# EAGLE design 1drv5 (EAGLE 7.2.0)
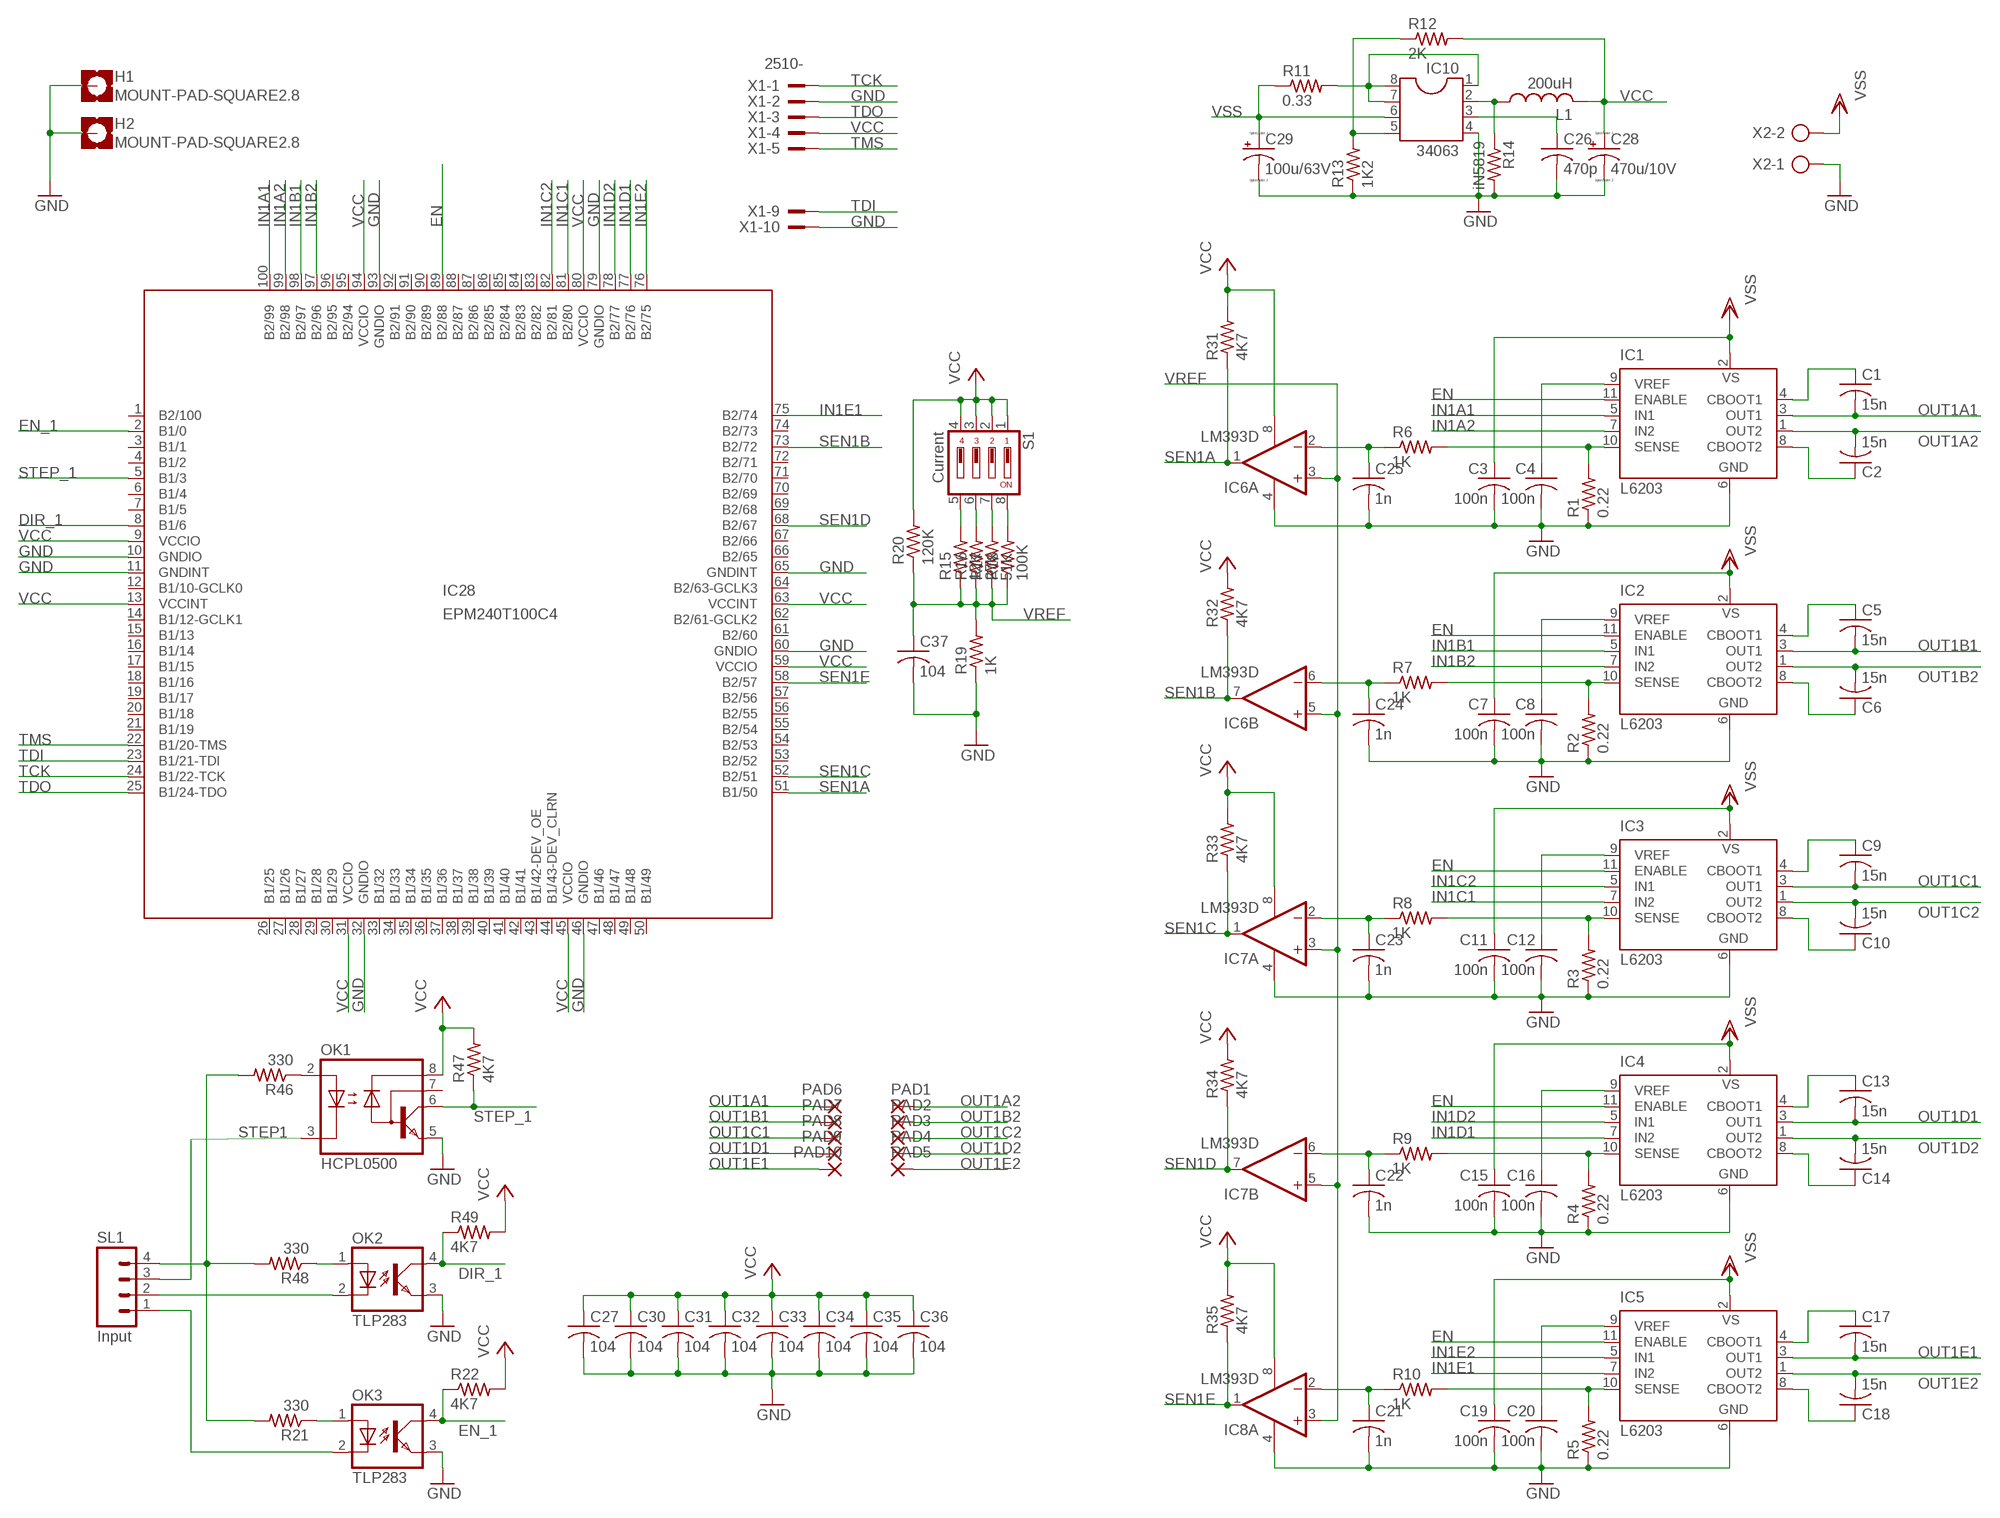
[diagram p0: schematic, sheet 1]

## Parts
C1  15n  C-US050-024X044  [C050-024X044]
C2  15n  C-US050-024X044  [C050-024X044]
C3  100n  C-US150-064X183  [C150-064X183]
C4  100n  C-US050-025X075  [C050-025X075]
C5  15n  C-US050-024X044  [C050-024X044]
C6  15n  C-US050-024X044  [C050-024X044]
C7  100n  C-US150-064X183  [C150-064X183]
C8  100n  C-US050-025X075  [C050-025X075]
C9  15n  C-US050-024X044  [C050-024X044]
C10  15n  C-US050-024X044  [C050-024X044]
C11  100n  C-US150-064X183  [C150-064X183]
C12  100n  C-US050-025X075  [C050-025X075]
C13  15n  C-US050-024X044  [C050-024X044]
C14  15n  C-US050-024X044  [C050-024X044]
C15  100n  C-US150-064X183  [C150-064X183]
C16  100n  C-US050-025X075  [C050-025X075]
C17  15n  C-US050-024X044  [C050-024X044]
C18  15n  C-US050-024X044  [C050-024X044]
C19  100n  C-US150-064X183  [C150-064X183]
C20  100n  C-US050-025X075  [C050-025X075]
C21  1n  C-USC1206  [C1206]
C22  1n  C-USC1206  [C1206]
C23  1n  C-USC1206  [C1206]
C24  1n  C-USC1206  [C1206]
C25  1n  C-USC1206  [C1206]
C26  470p  C-USC1206  [C1206]
C27  104  C-USC1206  [C1206]
C28  470u/10V  CPOL-USE3.5-8  [E3,5-8]
C29  100u/63V  CPOL-USE5-8.5  [E5-8,5]
C30  104  C-USC1206  [C1206]
C31  104  C-USC1206  [C1206]
C32  104  C-USC1206  [C1206]
C33  104  C-USC1206  [C1206]
C34  104  C-USC1206  [C1206]
C35  104  C-USC1206  [C1206]
C36  104  C-USC1206  [C1206]
C37  104  C-USC1206  [C1206]
H1  MOUNT-PAD-SQUARE2.8  [2,8-PAD-SQUARE]
H2  MOUNT-PAD-SQUARE2.8  [2,8-PAD-SQUARE]
IC1  L6203  [MULTIWATT-11]
IC2  L6203  [MULTIWATT-11]
IC3  L6203  [MULTIWATT-11]
IC4  L6203  [MULTIWATT-11]
IC5  L6203  [MULTIWATT-11]
IC6  LM393D  [SO08]
IC7  LM393D  [SO08]
IC8  LM393D  [SO08]
IC10  34063  DIL8  [DIL08]
IC28  EPM240T100C4  [TQFP100]
L1  200uH  L-US0207/5V  [0207/5V]
OK1  HCPL0500  [SOIC08]
OK2  TLP283  [MINI-FLAT-4]
OK3  TLP283  [MINI-FLAT-4]
PAD1  1,6/0,8  [1,6/0,8]
PAD2  1,6/0,8  [1,6/0,8]
PAD3  1,6/0,8  [1,6/0,8]
PAD4  1,6/0,8  [1,6/0,8]
PAD5  1,6/0,8  [1,6/0,8]
PAD6  1,6/0,8  [1,6/0,8]
PAD7  1,6/0,8  [1,6/0,8]
PAD8  1,6/0,8  [1,6/0,8]
PAD9  1,6/0,8  [1,6/0,8]
PAD10  1,6/0,8  [1,6/0,8]
R1  0.22  R-US_0411/3V  [0411V]
R2  0.22  R-US_0411/3V  [0411V]
R3  0.22  R-US_0411/3V  [0411V]
R4  0.22  R-US_0411/3V  [0411V]
R5  0.22  R-US_0411/3V  [0411V]
R6  1K  R-US_R1206  [R1206]
R7  1K  R-US_R1206  [R1206]
R8  1K  R-US_R1206  [R1206]
R9  1K  R-US_R1206  [R1206]
R10  1K  R-US_R1206  [R1206]
R11  0.33  R-US_0207/7  [0207/7]
R12  2K  R-US_0207/7  [0207/7]
R13  1K2  R-US_0207/7  [0207/7]
R14  iN5819  R-US_0414/5V  [0414V]
R15  12K  R-US_R1206  [R1206]
R16  27K  R-US_R1206  [R1206]
R17  51K  R-US_R1206  [R1206]
R18  100K  R-US_R1206  [R1206]
R19  1K  R-US_R1206  [R1206]
R20  120K  R-US_R1206  [R1206]
R21  330  R-US_R1206  [R1206]
R22  4K7  R-US_R1206  [R1206]
R31  4K7  R-US_R1206  [R1206]
R32  4K7  R-US_R1206  [R1206]
R33  4K7  R-US_R1206  [R1206]
R34  4K7  R-US_R1206  [R1206]
R35  4K7  R-US_R1206  [R1206]
R46  330  R-US_R1206  [R1206]
R47  4K7  R-US_R1206  [R1206]
R48  330  R-US_R1206  [R1206]
R49  4K7  R-US_R1206  [R1206]
S1  Current  DP04  [DP-04]
SL1  Input  M04  [04P]
X1  2510-  [PAK100/2500-10]
X2  AK500/2-H  [AK500/2-H]

## Nets
DIR_1: IC28.8(B1/6) OK2.4(COL) R49.1
EN: IC1.11(ENABLE) IC2.11(ENABLE) IC3.11(ENABLE) IC4.11(ENABLE) IC5.11(ENABLE) IC28.89(B2/88)
EN_1: IC28.2(B1/0) OK3.4(COL) R22.1
GND: C3.2 C4.2 C7.2 C8.2 C11.2 C12.2 C15.2 C16.2 C19.2 C20.2 C21.2 C22.2 C23.2 C24.2 C25.2 C26.2 C27.2 C28.- C29.- C30.2 C31.2 C32.2 C33.2 C34.2 C35.2 C36.2 C37.2 H1.B2,8(MOUNT) H2.B2,8(MOUNT) IC1.6(GND) IC2.6(GND) IC3.6(GND) IC4.6(GND) IC5.6(GND) IC6.4(P:V-) IC7.4(P:V-) IC8.4(P:V-) IC10.4 IC28.10(GNDIO) IC28.11(GNDINT) IC28.32(GNDIO) IC28.46(GNDIO) IC28.60(GNDIO) IC28.65(GNDINT) IC28.79(GNDIO) IC28.93(GNDIO) OK1.5(GND) OK2.3(EMIT) OK3.3(EMIT) R1.1 R2.1 R3.1 R4.1 R5.1 R13.1 R14.2 R19.1 X1.2 X1.10 X2.1
IN1A1: IC1.5(IN1) IC28.100(B2/99)
IN1A2: IC1.7(IN2) IC28.99(B2/98)
IN1B1: IC2.5(IN1) IC28.98(B2/97)
IN1B2: IC2.7(IN2) IC28.97(B2/96)
IN1C1: IC3.7(IN2) IC28.81(B2/80)
IN1C2: IC3.5(IN1) IC28.82(B2/81)
IN1D1: IC4.7(IN2) IC28.77(B2/76)
IN1D2: IC4.5(IN1) IC28.78(B2/77)
IN1E1: IC5.7(IN2) IC28.75(B2/74)
IN1E2: IC5.5(IN1) IC28.76(B2/75)
N$1: C8.1 IC2.9(VREF)
N$2: C1.1 IC1.4(CBOOT1)
N$3: C2.1 IC1.8(CBOOT2)
N$4: C4.1 IC1.9(VREF)
N$5: C5.1 IC2.4(CBOOT1)
N$6: C6.1 IC2.8(CBOOT2)
N$7: C12.1 IC3.9(VREF)
N$8: C9.1 IC3.4(CBOOT1)
N$9: C10.1 IC3.8(CBOOT2)
N$10: C16.1 IC4.9(VREF)
N$11: C13.1 IC4.4(CBOOT1)
N$12: C14.1 IC4.8(CBOOT2)
N$13: C20.1 IC5.9(VREF)
N$14: C17.1 IC5.4(CBOOT1)
N$15: C18.1 IC5.8(CBOOT2)
N$16: C25.1 IC6.2(A:-IN) R6.1
N$17: C21.1 IC8.2(A:-IN) R10.1
N$18: IC10.2 L1.1 R14.1
N$19: C22.1 IC7.6(B:-IN) R9.1
N$20: OK2.1(A) R48.1
N$21: C23.1 IC7.2(A:-IN) R8.1
N$22: C26.1 IC10.3
N$23: C24.1 IC6.6(B:-IN) R7.1
N$24: OK2.2(C) SL1.2
N$26: IC10.1 IC10.7 IC10.8 R11.2
N$27: R15.2 S1.5
N$28: R16.2 S1.6
N$29: IC10.5 R12.1 R13.2
N$30: R17.2 S1.7
N$31: R18.2 S1.8
N$33: R21.2 R46.2 R48.2 SL1.4
N$34: OK3.1(A) R21.1
N$35: OK3.2(C) SL1.1
N$62: OK1.2(A) R46.1
OUT1A1: C1.2 IC1.3(OUT1) PAD6.1(P)
OUT1A2: C2.2 IC1.1(OUT2) PAD1.1(P)
OUT1B1: C5.2 IC2.3(OUT1) PAD7.1(P)
OUT1B2: C6.2 IC2.1(OUT2) PAD2.1(P)
OUT1C1: C9.2 IC3.3(OUT1) PAD8.1(P)
OUT1C2: C10.2 IC3.1(OUT2) PAD3.1(P)
OUT1D1: C13.2 IC4.3(OUT1) PAD9.1(P)
OUT1D2: C14.2 IC4.1(OUT2) PAD4.1(P)
OUT1E1: C17.2 IC5.3(OUT1) PAD10.1(P)
OUT1E2: C18.2 IC5.1(OUT2) PAD5.1(P)
SEN1A: IC6.1(A:OUT) IC28.51(B1/50) R31.1
SEN1B: IC6.7(B:OUT) IC28.73(B2/72) R32.1
SEN1C: IC7.1(A:OUT) IC28.52(B2/51) R33.1
SEN1D: IC7.7(B:OUT) IC28.68(B2/67) R34.1
SEN1E: IC8.1(A:OUT) IC28.58(B2/57) R35.1
SEN_A: IC1.10(SENSE) R1.2 R6.2
SEN_B: IC2.10(SENSE) R2.2 R7.2
SEN_C: IC3.10(SENSE) R3.2 R8.2
SEN_D: IC4.10(SENSE) R4.2 R9.2
SEN_E: IC5.10(SENSE) R5.2 R10.2
STEP1: OK1.3(C) SL1.3
STEP_1: IC28.5(B1/3) OK1.6(VO) R47.1
TCK: IC28.24(B1/22-TCK) X1.1
TDI: IC28.23(B1/21-TDI) X1.9
TDO: IC28.25(B1/24-TDO) X1.3
TMS: IC28.22(B1/20-TMS) X1.5
VCC: C27.1 C28.+ C30.1 C31.1 C32.1 C33.1 C34.1 C35.1 C36.1 IC6.8(P:V+) IC7.8(P:V+) IC8.8(P:V+) IC28.9(VCCIO) IC28.13(VCCINT) IC28.31(VCCIO) IC28.45(VCCIO) IC28.59(VCCIO) IC28.63(VCCINT) IC28.80(VCCIO) IC28.94(VCCIO) L1.2 OK1.8(VCC) R12.2 R20.2 R22.2 R31.2 R32.2 R33.2 R34.2 R35.2 R47.2 R49.2 S1.1 S1.2 S1.3 S1.4 X1.4
VREF: C37.1 IC6.3(A:+IN) IC6.5(B:+IN) IC7.3(A:+IN) IC7.5(B:+IN) IC8.3(A:+IN) R15.1 R16.1 R17.1 R18.1 R19.2 R20.1
VSS: C3.1 C7.1 C11.1 C15.1 C19.1 C29.+ IC1.2(VS) IC2.2(VS) IC3.2(VS) IC4.2(VS) IC5.2(VS) IC10.6 R11.1 X2.2
Unconnected: IC8.5(B:+IN) IC8.6(B:-IN) IC8.7(B:OUT) IC28.1(B2/100) IC28.3(B1/1) IC28.4(B1/2) IC28.6(B1/4) IC28.7(B1/5) IC28.12(B1/10-GCLK0) IC28.14(B1/12-GCLK1) IC28.15(B1/13) IC28.16(B1/14) IC28.17(B1/15) IC28.18(B1/16) IC28.19(B1/17) IC28.20(B1/18) IC28.21(B1/19) IC28.26(B1/25) IC28.27(B1/26) IC28.28(B1/27) IC28.29(B1/28) IC28.30(B1/29) IC28.33(B1/32) IC28.34(B1/33) IC28.35(B1/34) IC28.36(B1/35) IC28.37(B1/36) IC28.38(B1/37) IC28.39(B1/38) IC28.40(B1/39) IC28.41(B1/40) IC28.42(B1/41) IC28.43(B1/42-DEV_OE) IC28.44(B1/43-DEV_CLRN) IC28.47(B1/46) IC28.48(B1/47) IC28.49(B1/48) IC28.50(B1/49) IC28.53(B2/52) IC28.54(B2/53) IC28.55(B2/54) IC28.56(B2/55) IC28.57(B2/56) IC28.61(B2/60) IC28.62(B2/61-GCLK2) IC28.64(B2/63-GCLK3) IC28.66(B2/65) IC28.67(B2/66) IC28.69(B2/68) IC28.70(B2/69) IC28.71(B2/70) IC28.72(B2/71) IC28.74(B2/73) IC28.83(B2/82) IC28.84(B2/83) IC28.85(B2/84) IC28.86(B2/85) IC28.87(B2/86) IC28.88(B2/87) IC28.90(B2/89) IC28.91(B2/90) IC28.92(B2/91) IC28.95(B2/94) IC28.96(B2/95) OK1.7(VB) X1.6 X1.7 X1.8

## Library data of the parts
C1-C27 C30-C37 = resistor:C-US: CAPACITOR, American symbol
C28 C29 = resistor:CPOL-US: POLARIZED CAPACITOR, American symbol
H1 H2 = holes:MOUNT-PAD-SQUARE: MOUNTING PAD, square
IC1-IC5 = st-microelectronics:L6203: DMOS FULL BRIDGE DRIVER; MPN: L6203; OC_FARNELL: 1467715; OC_NEWARK: 56P8434
IC6-IC8 = linear:LM393: COMPARATOR
IC10 = ic-package:DIL8: Dual In Line / Socket
IC28 = altera:EPM240T100C4: EPM240T100 Low-cost, low-power CPLD Auto generated by make-symbol-device-package-bsdl.ulp Rev. 35 Source: www.altera.com .. epm240-io.txt; MPN: EPM240T100C4; OC_FARNELL: 1453502; OC_NEWARK: 51R9357
L1 = resistor:L-US: INDUCTOR, American symbol
OK1 = optocoupler:HCPL0500: HEWLETT PACKARD OPTO COUPLER; MF: AGILENT TECHNOLOGIES; MPN: HCPL-0500-000E; OC_FARNELL: 9995226; OC_NEWARK: 31K6926
OK2 OK3 = optocoupler:TLP283: TOSHIBA PHOTOCOUPLER GaAs IRED & PHOTO-TRANSISTOR Source: http://www.semicon.toshiba.co.jp/td/en/Opto/Photocoupler/en_20050928_TLP283_datasheet.pdf; OC_FARNELL: unknown; OC_NEWARK: unknown
PAD1-PAD10 = wirepad:1,6/0,8: THROUGH-HOLE PAD
R1-R22 R31-R35 R46-R49 = resistor:R-US_: RESISTOR, American symbol
S1 = switch-dil:DP04: DIL/CODE SWITCH; MPN: DP04; OC_FARNELL: 9471600; OC_NEWARK: 73J0027
SL1 = con-amp-quick:M04: AMP QUICK CONNECTOR; OC_FARNELL: unknown; OC_NEWARK: unknown
X1 = con-3m:2510-: 3M (TM) Pak 100 4-Wall Header Source: 3M; MF: 3M; MPN: 2510-6002UB; OC_FARNELL: 9838244; OC_NEWARK: 46F4725
X2 = con-ptr500:AK500/2-H: CONNECTOR Aug. 2004 / PTR Meßtechnik: Die Bezeichnung der Serie AK505 wurde geändert. Es handelt sich hierbei um AK500 in horizontaler Ausführung.; OC_FARNELL: unknown; OC_NEWARK: unknown

## Board
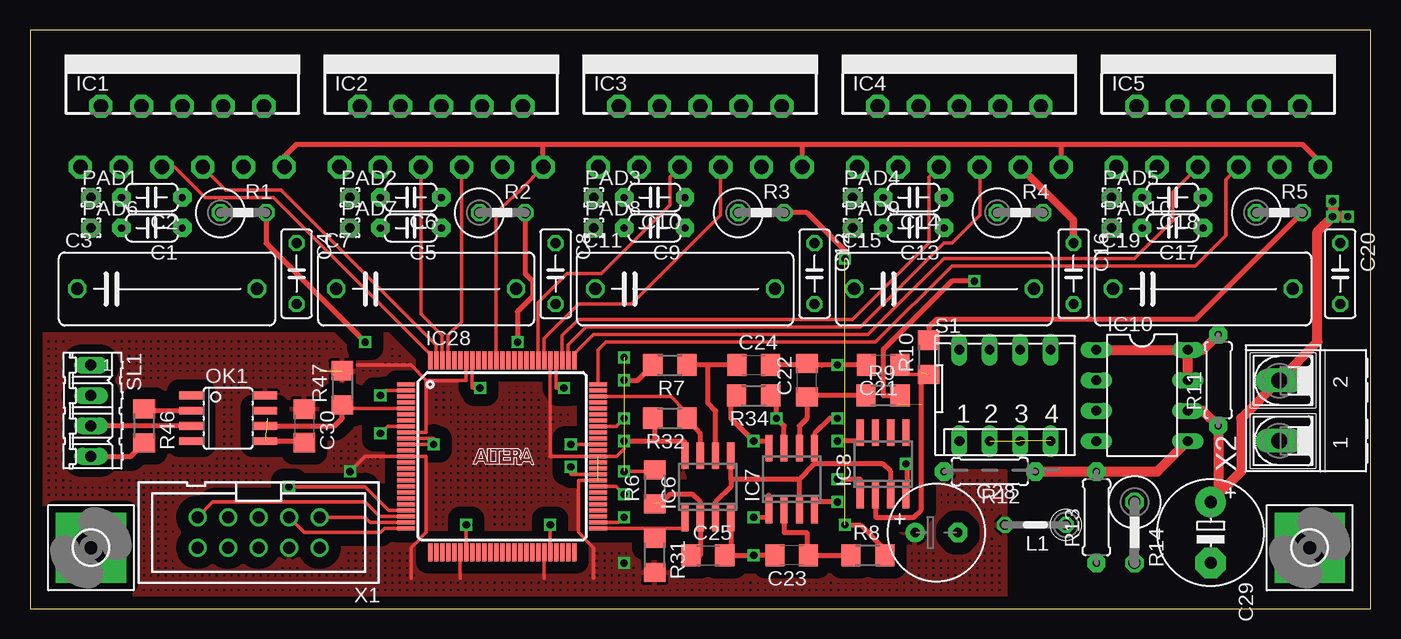
[diagram p1: board, top side]
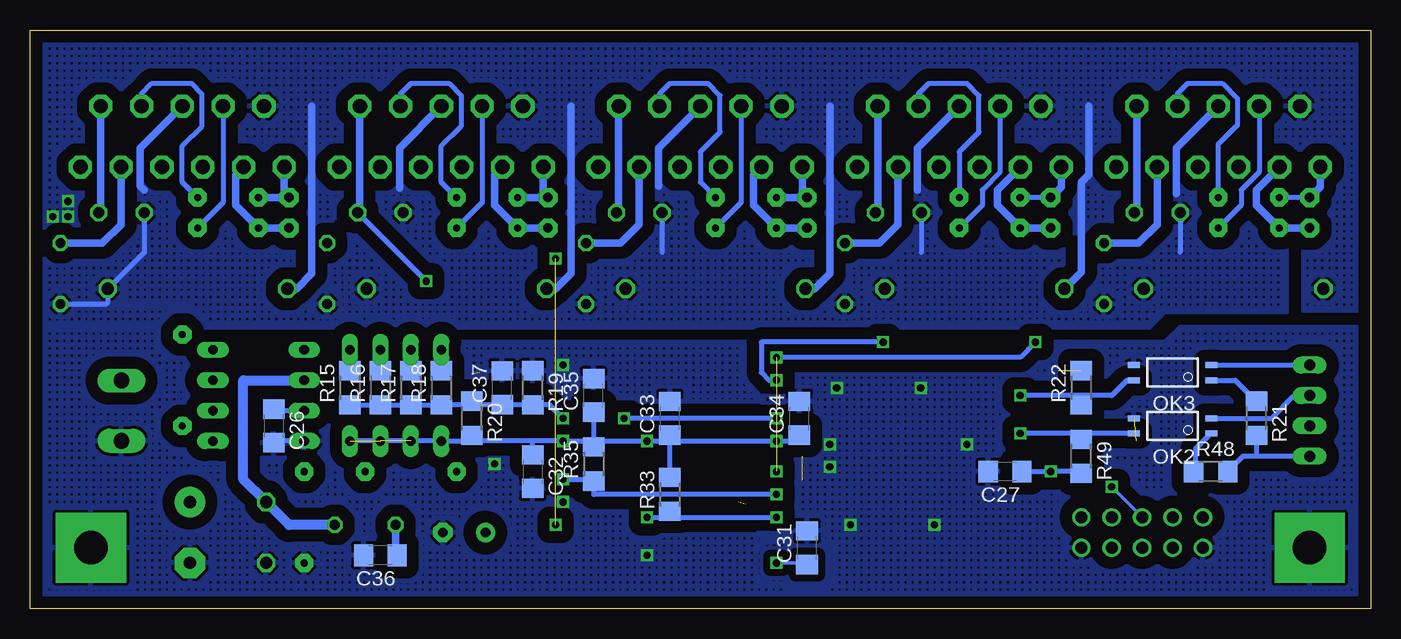
[diagram p2: board, bottom side, seen from below]

Size 111.76 x 48.26 mm. Coordinates in mm from the lower left corner, seen from the top.
Outline: 0,0 111.76,0 111.76,48.26 0,48.26 0,0
Copper layers (1*16): Top 0.035mm / dielectric 1.5mm / Bottom 0.035mm
Design rules "default": minimum track width 10mil, minimum drill 24mil, track to track 8mil, track to pad 8mil, pad to pad 8mil, via to via 8mil, smd to smd 8mil, copper to edge 40mil, drill to drill 8mil, minimum pad ring 10mil, minimum via ring 8mil, stop-mask expansion 4mil, vias tented up to drill 0mil, thermal gap 10mil

### Footprints (pad centres in the part's own frame; a part is rotated, then mirrored left to right if it is on the bottom)
C050-024X044 = drill 0.6 pad 1.524 octagon: 1 -2.54,0; 2 2.54,0
C150-064X183 = drill 1.016 octagon: 1 -7.493,0; 2 7.493,0
C050-025X075 = drill 0.813 octagon: 1 -2.54,0; 2 2.54,0
C1206 = smd 1.6 x 1.8: 1 -1.4,0; 2 1.4,0
E3,5-8 = drill 0.813 pad 1.6: + -1.778,0 | drill 0.813 pad 1.6 octagon: - 1.778,0
E5-8,5 = drill 1.016 pad 2.54: + -2.54,0 | drill 1.016 pad 2.54 octagon: - 2.54,0
2,8-PAD-SQUARE = drill 2.8 pad 5.842 square: B2,8 0,0
MULTIWATT-11 = drill 1.2 pad 1.93 octagon: 1 -8.5,-6.35; 2 -6.8,-1.27; 3 -5.1,-6.35; 4 -3.4,-1.27; 5 -1.7,-6.35; 6 0,-1.27; 7 1.7,-6.35; 8 3.4,-1.27; 9 5.1,-6.35; 10 6.8,-1.27; 11 8.5,-6.35
SO08 = smd 0.6 x 2.2: 1 -1.905,-2.6; 2 -0.635,-2.6; 3 0.635,-2.6; 4 1.905,-2.6; 5 1.905,2.6; 6 0.635,2.6; 7 -0.635,2.6; 8 -1.905,2.6
DIL08 = drill 0.813 long: 1 -3.81,-3.81; 2 -1.27,-3.81; 3 1.27,-3.81; 4 3.81,-3.81; 5 3.81,3.81; 6 1.27,3.81; 7 -1.27,3.81; 8 -3.81,3.81
TQFP100 = smd 1.5 x 0.35: 1 -8,6; 2 -8,5.5; 3 -8,5; 4 -8,4.5; 5 -8,4; 6 -8,3.5; 7 -8,3; 8 -8,2.5; 9 -8,2; 10 -8,1.5; 11 -8,1; 12 -8,0.5; 13 -8,0; 14 -8,-0.5; 15 -8,-1; 16 -8,-1.5; 17 -8,-2; 18 -8,-2.5; 19 -8,-3; 20 -8,-3.5; 21 -8,-4; 22 -8,-4.5; 23 -8,-5; 24 -8,-5.5; 25 -8,-6; 51 8,-6; 52 8,-5.5; 53 8,-5; 54 8,-4.5; 55 8,-4; 56 8,-3.5; 57 8,-3; 58 8,-2.5; 59 8,-2; 60 8,-1.5; 61 8,-1; 62 8,-0.5; 63 8,0; 64 8,0.5; 65 8,1; 66 8,1.5; 67 8,2; 68 8,2.5; 69 8,3; 70 8,3.5; 71 8,4; 72 8,4.5; 73 8,5; 74 8,5.5; 75 8,6 | smd 0.35 x 1.5: 26 -6,-8; 27 -5.5,-8; 28 -5,-8; 29 -4.5,-8; 30 -4,-8; 31 -3.5,-8; 32 -3,-8; 33 -2.5,-8; 34 -2,-8; 35 -1.5,-8; 36 -1,-8; 37 -0.5,-8; 38 0,-8; 39 0.5,-8; 40 1,-8; 41 1.5,-8; 42 2,-8; 43 2.5,-8; 44 3,-8; 45 3.5,-8; 46 4,-8; 47 4.5,-8; 48 5,-8; 49 5.5,-8; 50 6,-8; 76 6,8; 77 5.5,8; 78 5,8; 79 4.5,8; 80 4,8; 81 3.5,8; 82 3,8; 83 2.5,8; 84 2,8; 85 1.5,8; 86 1,8; 87 0.5,8; 88 0,8; 89 -0.5,8; 90 -1,8; 91 -1.5,8; 92 -2,8; 93 -2.5,8; 94 -3,8; 95 -3.5,8; 96 -4,8; 97 -4.5,8; 98 -5,8; 99 -5.5,8; 100 -6,8
0207/5V = drill 0.813 octagon: 1 -2.54,0; 2 2.54,0
SOIC08 = smd 0.66 x 2.032: 1 -1.905,-3.073; 2 -0.635,-3.073; 3 0.635,-3.073; 4 1.905,-3.073; 5 1.905,3.073; 6 0.635,3.073; 7 -0.635,3.073; 8 -1.905,3.073
MINI-FLAT-4 = smd 1 x 0.5: 1 -3.24,0.635; 2 -3.24,-0.635; 3 3.24,-0.635; 4 3.24,0.635
1,6/0,8 = drill 0.8 pad 1.6 octagon: 1 0,0
0411V = drill 0.914 octagon: 1 -2.54,0; 2 1.27,0
R1206 = smd 1.6 x 1.803: 1 -1.422,0; 2 1.422,0
0207/7 = drill 0.6 pad 1.524 octagon: 1 -3.81,0; 2 3.81,0
0414V = drill 1.016 octagon: 1 -2.54,0; 2 2.54,0
DP-04 = drill 0.813 long: 1 -3.81,-3.81; 2 -1.27,-3.81; 3 1.27,-3.81; 4 3.81,-3.81; 5 3.81,3.81; 6 1.27,3.81; 7 -1.27,3.81; 8 -3.81,3.81
04P = drill 0.914 long: 1 -3.81,0; 2 -1.27,0; 3 1.27,0; 4 3.81,0
PAK100/2500-10 = drill 1 pad 1.422: 1 -5.08,-1.27; 2 -5.08,1.27; 3 -2.54,-1.27; 4 -2.54,1.27; 5 0,-1.27; 6 0,1.27; 7 2.54,-1.27; 8 2.54,1.27; 9 5.08,-1.27; 10 5.08,1.27
AK500/2-H = drill 1.321 long: 1 -2.515,0; 2 2.515,0

### Placement (x,y rotation side)
C1  10.16,31.75 180 top
C2  10.16,34.29 180 top
C3  11.43,26.67 0 top
C4  22.22,27.94 270 top
C5  31.75,31.75 180 top
C6  31.75,34.29 180 top
C7  33.02,26.67 0 top
C8  43.82,27.94 270 top
C9  52.07,31.75 180 top
C10  52.07,34.29 180 top
C11  54.61,26.67 0 top
C12  65.41,27.94 270 top
C13  73.66,31.75 180 top
C14  73.66,34.29 180 top
C15  76.2,26.67 0 top
C16  86.99,27.94 270 top
C17  95.25,31.75 180 top
C18  95.25,34.29 180 top
C19  97.79,26.67 0 top
C20  109.22,27.94 270 top
C21  71.12,20.32 180 top
C22  64.77,19.05 90 top
C23  63.5,4.45 180 top
C24  60.33,20.32 0 top
C25  56.52,4.45 0 top
C26  91.44,15.24 270 bottom
C27  30.48,11.43 180 bottom
C28  75.56,6.35 0 top
C29  98.42,6.35 270 top
C30  22.86,15.24 270 top
C31  46.99,5.08 90 bottom
C32  69.85,11.43 270 bottom
C33  58.42,15.88 90 bottom
C34  47.62,15.88 90 bottom
C35  64.77,17.78 90 bottom
C36  82.55,4.45 180 bottom
C37  72.39,18.41 90 bottom
H1  5.08,5.08 0 top
H2  106.68,5.08 0 top
IC1  12.7,43.18 0 top
IC2  34.29,43.18 0 top
IC3  55.88,43.18 0 top
IC4  77.47,43.18 0 top
IC5  99.06,43.18 0 top
IC6  56.52,10.16 0 top
IC7  63.5,10.79 0 top
IC8  71.12,12.06 0 top
IC10  92.71,17.78 270 top
IC28  39.37,12.7 0 top
L1  83.82,6.98 180 top
OK1  16.51,15.88 270 top
OK2  16.51,15.24 180 bottom
OK3  16.51,19.68 180 bottom
PAD1  5.08,34.29 0 top
PAD2  26.67,34.29 0 top
PAD3  46.99,34.29 0 top
PAD4  68.58,34.29 0 top
PAD5  90.17,34.29 0 top
PAD6  5.08,31.75 0 top
PAD7  26.67,31.75 0 top
PAD8  46.99,31.75 0 top
PAD9  68.58,31.75 0 top
PAD10  90.17,31.75 0 top
R1  18.41,33.02 0 top
R2  40.01,33.02 0 top
R3  61.6,33.02 0 top
R4  83.19,33.02 0 top
R5  104.77,33.02 0 top
R6  52.07,10.16 90 top
R7  53.34,20.32 180 top
R8  69.85,4.45 0 top
R9  71.12,17.78 0 top
R10  74.93,20.95 90 top
R11  99.06,19.05 90 top
R12  80.01,11.43 180 top
R13  88.9,7.62 90 top
R14  92.08,6.35 270 top
R15  85.09,18.41 90 bottom
R16  82.55,18.41 90 bottom
R17  80.01,18.41 90 bottom
R18  77.47,18.41 90 bottom
R19  69.85,18.41 270 bottom
R20  74.93,15.88 270 bottom
R21  9.53,15.88 270 bottom
R22  24.13,18.41 90 bottom
R31  52.07,4.45 270 top
R32  53.34,15.88 180 top
R33  58.42,9.53 90 bottom
R34  60.33,17.78 180 top
R35  64.77,12.06 90 bottom
R46  9.53,15.24 270 top
R47  26.04,18.41 90 top
R48  13.33,11.43 0 bottom
R49  24.13,12.7 270 bottom
S1  81.28,17.78 0 top
SL1  5.08,16.51 270 top
X1  19.05,6.35 180 top
X2  104.14,16.51 90 top

### Tracks (layer width: path | path; a pad name or v marks a point on that pad's centre or on a via)
DIR_1  (via drill 0.6)
  Top 0.305: IC28.8 29.8,15.2 v29.21,14.61
  Bottom 0.406: OK2.4 24.13,14.61 | 24.13,14.61 v29.21,14.61 | 24.13,13.97 R49.1 24.13,14.61
EN
  Top 0.305: IC28.89 38.87,33.02 40.89,34.93 IC2.11
  Top 0.406: IC1.11 21.2,37.71 22.22,38.74 42.79,38.74 | 42.79,38.74 64.38,38.74 | 64.38,38.74 85.97,38.74 | 85.97,38.74 106.05,38.74 107.56,37.22 IC5.11 | IC4.11 85.97,38.74 | IC3.11 64.38,38.74 | IC2.11 42.79,38.74
EN_1  (via drill 0.6)
  Top 0.305: IC28.2 29.63,18.2 v29.21,17.78
  Bottom 0.406: OK3.4 20.32,19.05 21.59,17.78 24.13,17.78 | 24.13,17.78 v29.21,17.78 | R22.1 24.13,17.78
GND  (via drill 0.6)  (1 unrouted)
  Top 0.305: IC28.10 33.66,14.2 v33.66,13.7 IC28.11 | IC28.46 v43.37,6.98 | IC28.32 v36.37,6.98 | IC28.93 36.87,18.41 v37.51,18.41 | IC28.65 v45.09,13.7 | IC28.79 43.87,18.41 v44.51,18.41 | IC28.60 45.09,11.2 v45.09,11.83
  Top 0.406: IC8.4 73.08,10.1 73.08,12.06 v73.02,12.06 | C25.2 58.42,4.45 | IC6.4 58.42,4.45 | C21.2 v67.31,20.32 66.04,20.32 | 66.04,20.32 C24.2 | C22.2 66.04,20.32 | 65.41,8.26 IC7.4 65.41,8.89 v67.31,8.89 | 58.42,4.45 v60.33,4.45 C23.2 | OK1.5 22.73,13.97 C30.2
  Bottom 0.406: R1.1 15.88,29.72 | R2.1 37.47,29.72 | R3.1 59.05,29.72 | C20.2 105.41,25.4 105.28,25.53 C19.2 102.23,29.72 R5.1 | IC10.4 91.31,13.97 C26.2
  Bottom 0.61: IC5.6 102.55,38.42 102.55,35.24 102.23,34.93 | IC4.6 80.96,38.42 80.96,35.08 | IC3.6 59.37,38.42 59.37,35.24 | IC2.6 37.78,38.42 37.78,34.93 | IC1.6 16.19,38.42 16.19,34.61
  pour Bottom (isolate 1.016, hatched): 98.42,25.4 98.42,22.22 17.14,22.22 15.88,23.5 -3.81,23.5 -3.81,-3.81 113.03,-3.81 113.03,25.4
  pour Bottom (isolate 1.016, hatched): 106.68,36.83 106.68,30.48 113.03,30.48 113.03,23.5 18.41,23.5 17.14,24.77 6.98,24.77 6.98,36.83
  pour Bottom (isolate 0.61, rank 2, hatched): 45.09,6.35 51.12,6.35 51.12,1.91 45.09,1.91
  pour Bottom (isolate 0.61, hatched): 47.94,17.78 50.8,17.78 50.8,17.14 47.94,17.14
IN1A1
  Top 0.305: IC28.100 33.37,21.24 20.32,34.29 14.61,34.29 12.06,36.83 IC1.5
IN1A2
  Top 0.305: IC28.99 33.87,22.01 20.95,34.93 16.3,34.93 IC1.7
IN1B1
  Top 0.305: IC28.98 34.37,22.78 32.59,24.56 IC2.5
IN1B2
  Top 0.305: IC2.7 35.99,23.93 34.87,22.8 IC28.97
IN1C1
  Top 0.305: IC3.7 57.58,32.82 50.17,25.4 45.72,25.4 42.87,22.55 IC28.81
IN1C2
  Top 0.305: IC3.5 53.34,35.99 53.34,33.66 47.62,27.94 44.77,27.94 42.37,25.54 IC28.82
IN1D1
  Top 0.305: IC4.7 79.17,32.82 76.83,30.48 76.2,30.48 69.21,23.5 46.36,23.5 44.87,22.01 IC28.77
IN1D2
  Top 0.305: IC4.5 74.93,35.99 74.93,30.48 68.58,24.13 45.72,24.13 44.37,22.78 IC28.78
IN1E1
  Top 0.305: IC28.75 47.37,21.59 48.01,22.22 70.48,22.22 76.83,28.57 97.16,28.57 99.69,31.11 99.69,35.77 IC5.7
IN1E2
  Top 0.305: IC5.5 95.25,34.72 95.25,32.38 92.08,29.21 76.2,29.21 69.85,22.86 46.99,22.86 45.37,21.24 IC28.76
N$1
  Bottom 0.61: IC2.9 39.39,32.05 40.96,30.48 C8.1
N$2
  Bottom 0.406: IC1.4 9.3,36.42 10.79,34.93 10.79,33.66 C1.1
N$3
  Bottom 0.406: C2.1 12.7,38.74 11.11,40.32 11.11,42.55 12.38,43.82 15.24,43.82 16.1,42.96 IC1.8
N$4
  Bottom 0.61: IC1.9 17.8,32.05 19.37,30.48 C4.1
N$5
  Bottom 0.406: IC2.4 30.89,36.42 32.38,34.93 32.38,33.66 C5.1
N$6
  Bottom 0.406: IC2.8 37.69,42.96 36.83,43.82 33.66,43.82 32.64,42.8 32.64,39.75 34.29,38.1 C6.1
N$7
  Bottom 0.61: IC3.9 60.98,32.05 62.55,30.48 C12.1
N$8
  Bottom 0.406: IC3.4 52.48,33.88 C9.1
N$9
  Bottom 0.406: IC3.8 59.28,42.96 58.42,43.82 55.25,43.82 54.23,42.8 54.23,39.75 55.88,38.1 55.88,35.56 C10.1
N$10
  Top 0.61: C16.1 86.99,32.41 IC4.9
N$11
  Bottom 0.406: IC4.4 74.07,33.88 C13.1
N$12
  Bottom 0.406: IC4.8 80.87,42.96 80.01,43.82 76.83,43.82 75.82,42.8 75.82,40.26 77.47,38.61 77.47,35.56 C14.1
N$13
  Bottom 0.61: IC5.9 104.16,32.05 105.73,30.48 C20.1
N$14
  Bottom 0.406: IC5.4 95.66,33.88 C17.1
N$15
  Bottom 0.406: IC5.8 102.46,42.96 101.6,43.82 98.3,43.82 97.41,42.93 97.41,40.26 99.06,38.61 99.06,35.56 C18.1
N$16  (1 unrouted)
  Top 0.406: C25.1 55.88,4.45 IC6.2 55.88,8.89 55.25,9.53 53.34,9.53 52.71,8.89
N$17  (1 unrouted)
  Top 0.305: R10.1 72.54,19.53 72.39,19.68 72.39,20.19 C21.1
  Top 0.406: IC8.2 70.48,7.62 73.66,7.62 74.3,8.26 74.3,19.68
N$18
  Bottom 0.813: L1.1 90.17,6.98 R14.1 93.98,10.79 93.98,19.05 IC10.2
N$19
  Top 0.406: R9.1 64.9,17.78 C22.1 64.77,15.88 64.14,15.24 IC7.6
N$20
  Bottom 0.406: OK2.1 13.33,14.61 14.61,13.33 14.61,11.58 R48.1
N$21
  Top 0.406: R8.1 C23.1 64.77,4.58 64.77,6.35 62.87,6.35 IC7.2
N$22
  Bottom 0.406: IC10.3 91.31,16.51 C26.1
N$23
  Top 0.406: C24.1 56.52,20.32 | 56.52,20.32 R7.1 | IC6.6 57.15,16.51 56.52,17.14 56.52,20.32
N$24
  Bottom 0.406: OK2.2 8.26,15.88 6.35,17.78 SL1.2
N$26
  Top 0.813: IC10.1 IC10.8 | IC10.8 97.79,21.59 R11.2 | IC10.7 IC10.8
N$27
  Bottom 0.406: S1.5 R15.2
N$28
  Bottom 0.406: S1.6 R16.2
N$29
  Top 0.813: R12.1 R13.2 93.98,11.43 IC10.5
N$30
  Bottom 0.406: S1.7 R17.2
N$31
  Bottom 0.406: R18.2 S1.8
N$33
  Top 0.406: SL1.4 8.41,12.7 R46.2
  Bottom 0.406: SL1.4 9.53,12.7 | 9.53,12.7 10.64,12.7 R48.2 | R21.2 9.53,12.7
N$34
  Bottom 0.406: OK3.1 11.28,19.05 R21.1
N$35
  Bottom 0.406: OK3.2 SL1.1
N$62
  Top 0.406: OK1.2 9.53,16.51 R46.1
OUT1A1
  Bottom 0.406: IC1.3 7.62,36.83
  Bottom 0.61: PAD6.1 C1.2 9.53,33.66 9.53,34.93 7.62,36.83
OUT1A2
  Bottom 0.406: PAD1.1 C2.2
  Bottom 0.61: IC1.1 4.2,35.17 PAD1.1
OUT1B1
  Bottom 0.406: IC2.3 29.21,36.83
  Bottom 0.61: PAD7.1 C5.2 31.11,33.66 31.11,34.93 29.21,36.83
OUT1B2
  Bottom 0.406: PAD2.1 C6.2
  Bottom 0.61: IC2.1 25.79,35.17 PAD2.1
OUT1C1
  Bottom 0.406: IC3.3 50.8,36.83
  Bottom 0.61: PAD8.1 C9.2 51.44,33.66 51.44,36.2 50.8,36.83
OUT1C2
  Bottom 0.61: PAD3.1 47.38,34.29 | 47.38,34.29 C10.2 | IC3.1 47.38,34.29
OUT1D1
  Bottom 0.61: PAD9.1 C13.2 73.02,33.66 73.02,36.18 IC4.3
OUT1D2
  Bottom 0.61: IC4.1 68.97,34.29 PAD4.1 C14.2
OUT1E1
  Bottom 0.61: PAD10.1 C17.2 94.61,33.66 94.61,36.18 IC5.3
OUT1E2
  Bottom 0.61: IC5.1 90.56,34.29 | 90.56,34.29 C18.2 | PAD5.1 90.56,34.29
SEN1A
  Top 0.305: IC28.51 52.07,6.7 | 52.07,6.7 54.41,6.7 54.41,6.79 54.61,6.98 IC6.1 | R31.1 52.07,6.7
SEN1B
  Top 0.305: IC28.73 53.42,17.7 54.61,16.51 54.61,16.03 R32.1
  Top 0.406: IC6.7 55.88,14.61 R32.1
SEN1C  (via drill 0.6)
  Top 0.305: IC28.52 49.11,7.2 v49.53,7.62
  Top 0.406: v60.33,7.62 61.54,7.56 IC7.1 61.6,9.46
  Bottom 0.406: v60.33,7.62 57.79,7.62 | 57.79,7.62 v49.53,7.62 | R33.1 57.79,7.62
SEN1D  (via drill 0.6)
  Top 0.305: IC28.68 48.9,15.2 48.9,15.24 v49.53,15.88
  Top 0.406: IC7.7 62.87,15.24 v62.23,15.88 62.23,17.93 R34.1
  Bottom 0.406: v49.53,15.88 v62.23,15.88
SEN1E  (via drill 0.6)
  Top 0.305: IC28.58 48.86,10.2 v49.53,9.53
  Top 0.406: IC8.1 69.21,10.79 v67.31,10.79
  Bottom 0.406: v49.53,9.53 64.77,9.53 R35.1 64.92,10.79 v67.31,10.79
SEN_A  (via drill 0.6)  (1 unrouted)
  Top 0.305: v49.53,11.43 51.92,11.43 R6.2
  Top 0.406: v27.94,22.22 19.68,30.48 R1.2
  Bottom 0.406: v27.94,22.22 29.21,20.95 v49.53,20.95
  Bottom 0.61: IC1.10 19.5,33.2 R1.2
SEN_B  (via drill 0.6)
  Top 0.406: R2.2 41.28,27.94 41.91,27.3 41.91,26.04 40.64,24.77 v40.64,22.22 | v49.53,19.05 50.65,19.05 R7.2
  Bottom 0.406: v40.64,22.22 50.8,22.22 50.8,19.68 50.17,19.05 v49.53,19.05
  Bottom 0.61: IC2.10 41.09,33.2 R2.2
SEN_C  (via drill 0.6)  (1 unrouted)
  Top 0.406: R3.2 64.77,33.02 67.94,29.84 v67.94,29.21 | v67.94,6.98 69.21,6.98 71.12,5.08 71.12,4.6 R8.2
  Bottom 0.61: IC3.10 62.68,33.47 R3.2
SEN_D  (via drill 0.6)
  Top 0.406: v78.74,27.3 76.83,27.3 71.12,21.59 71.12,17.78 R9.2
  Bottom 0.406: R4.2 v78.74,27.3
  Bottom 0.61: IC4.10 84.27,33.47 R4.2
SEN_E
  Top 0.406: R10.2 74.93,23.5 75.56,24.13 97.16,24.13 R5.2
  Bottom 0.61: IC5.10 105.86,33.47 R5.2
STEP1
  Top 0.406: OK1.3 SL1.3
STEP_1
  Top 0.305: IC28.5 27.01,16.7 R47.1
  Top 0.406: OK1.6 25.4,15.24 26.04,15.88 R47.1
TCK
  Top 0.305: IC28.24 28.36,7.2 27.94,7.62 X1.1
TDI
  Top 0.305: IC28.23 29.13,7.7 27.94,8.89 15.24,8.89 X1.9
TDO
  Top 0.305: 31.46,6.7 IC28.25 29.56,6.7 29.21,6.35 22.86,6.35 X1.3
TMS  (via drill 0.6)
  Top 0.305: v21.59,10.16 27.94,10.16 29.9,8.2 IC28.22
  Bottom 0.305: v21.59,10.16 X1.5
VCC  (via drill 0.6)  (4 unrouted)
  Top 0.305: IC28.45 42.87,2.54 | IC28.31 35.87,2.54 | IC28.59 45.72,10.7 45.72,6.35 46.99,5.08 46.99,2.54 | 31.75,2.54 31.75,5.08 33.02,6.35 33.02,12.7 IC28.13 27.94,12.7 v26.67,11.43 | IC28.9 33.02,14.7 33.02,19.05 | IC28.94 36.37,19.05 33.02,19.05 | 33.02,19.05 31.75,20.32 27.3,20.32 | IC28.80 43.37,12.7 IC28.63 48.9,12.7 49.53,13.33 v49.53,13.97 | R47.2 26.04,19.05
  Top 0.406: IC7.8 61.54,13.97 v60.33,13.97 58.42,15.88 58.42,17.63 R34.2 | R32.2 52.07,15.72 52.07,13.97 | v49.53,13.97 52.07,13.97 | 52.07,13.97 54.55,13.97 IC6.8 | IC8.8 69.21,13.97 v67.31,13.97
  Bottom 0.305: C31.1 46.99,3.81 v49.53,3.81
  Bottom 0.406: 58.42,13.97 v60.33,13.97 64.77,13.97 R35.2 | 58.42,13.97 v49.53,13.97 48.13,13.97 C34.1 | R33.2 58.42,13.97 | S1.4 S1.1 74.3,13.97 | C33.1 58.42,13.97 | 64.92,13.33 R35.2 | R35.2 65.25,13.97 v67.31,13.97 69.85,13.97 | R20.2 74.3,13.97 | 69.85,13.97 74.3,13.97 | C32.1 69.85,13.97 | C35.1 R35.2 | R49.2 24.13,11.43 v26.67,11.43 C27.1
  Bottom 0.61: L1.2 81.28,4.58 C36.1
  pour Top (isolate 1.016, rank 2, hatched): -1.27,22.86 48.26,22.86 48.26,11.43 81.28,11.43 81.28,-1.27 -1.27,-1.27
VREF  (via drill 0.6)  (1 unrouted)
  Top 0.406: IC6.3 57.15,8.89 58.42,10.16 58.42,10.79 | 58.42,10.79 IC6.5 | IC7.3 64.14,10.79 | 64.14,10.79 58.42,10.79 | IC8.3 71.75,11.43 71.12,12.06 65.41,12.06 | 65.41,12.06 IC7.5 65.41,14.61 66.67,15.88 v67.31,15.88 | 64.14,10.79 65.41,12.06
  Bottom 0.406: R15.1 R16.1 R17.1 R18.1 74.3,16.99 | v67.31,15.88 68.43,16.99 R19.2 74.3,16.99 | R20.1 74.3,16.99
VSS  (via drill 0.6)
  Top 0.813: v108.58,32.7 107.31,31.43 107.31,22.22 104.14,19.05 X2.2 104.11,19.02 100.96,15.88 100.96,11.43 99.06,9.53 | v108.58,33.97 v108.58,32.7 | IC10.6 97.79,16.51 R11.1 99.06,9.53 | 99.06,9.53 C29.+ | v109.85,32.7 v108.58,32.7
  Bottom 0.406: C19.1 90.17,26.67 | 104.11,19.05 X2.2
  Bottom 0.61: 45.09,41.91 45.09,27.94 46.36,26.67 C11.1 | C15.1 67.94,26.67 66.67,27.94 66.67,41.91 | 88.27,41.91 88.27,27.94 89.53,26.67 C19.1 | 23.5,41.91 23.5,36.2 24.13,35.56 24.13,28.07 C7.1
  pour Bottom (isolate 1.016, rank 2, hatched): -1.27,49.53 -1.27,23.5 114.3,23.5 114.3,49.53